# Altium schematic sheet 2.SchDoc
size 386 x 246 mm
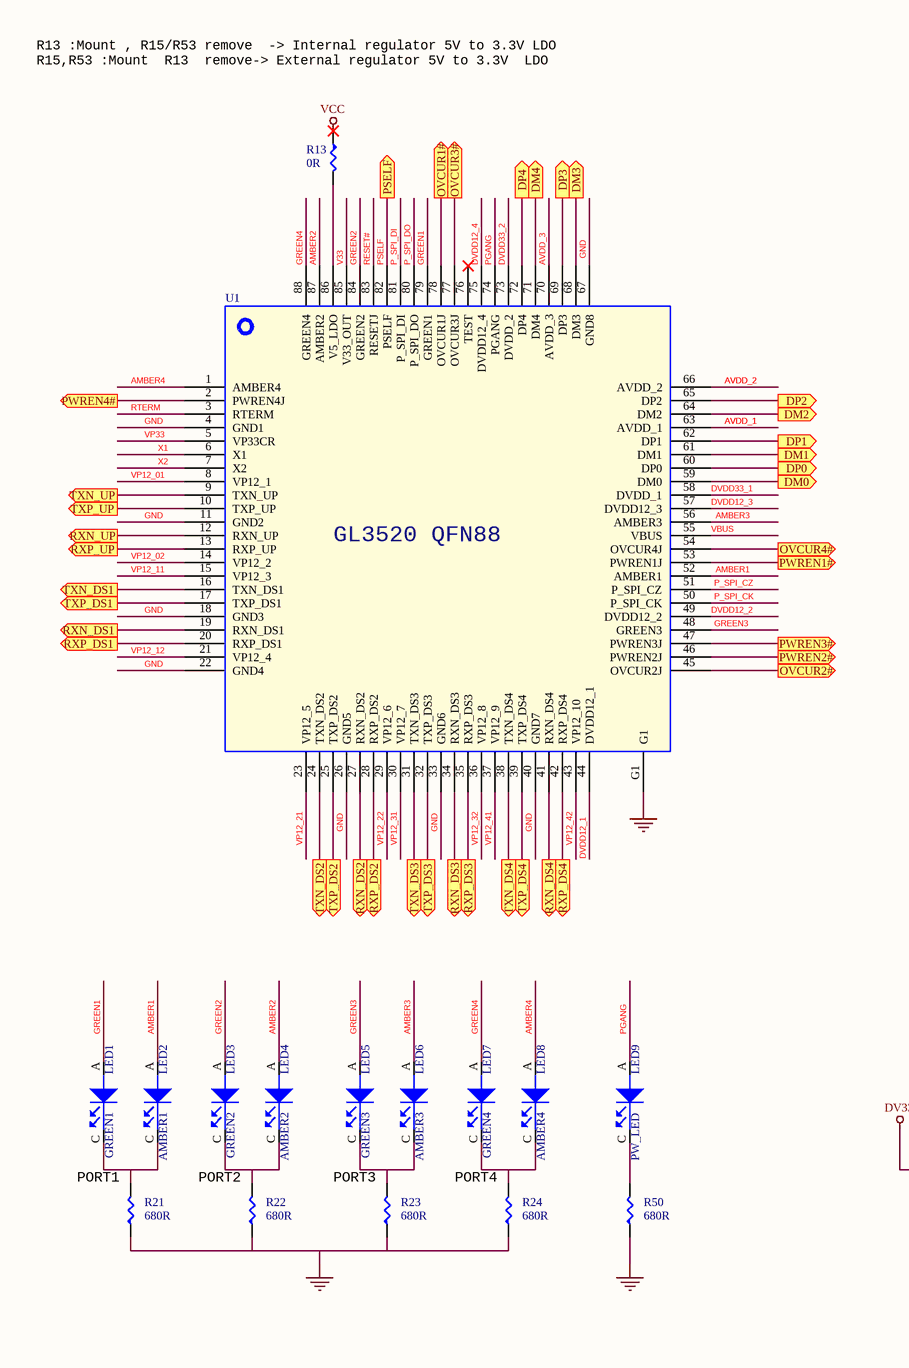
[diagram p0: 2.SchDoc, left]
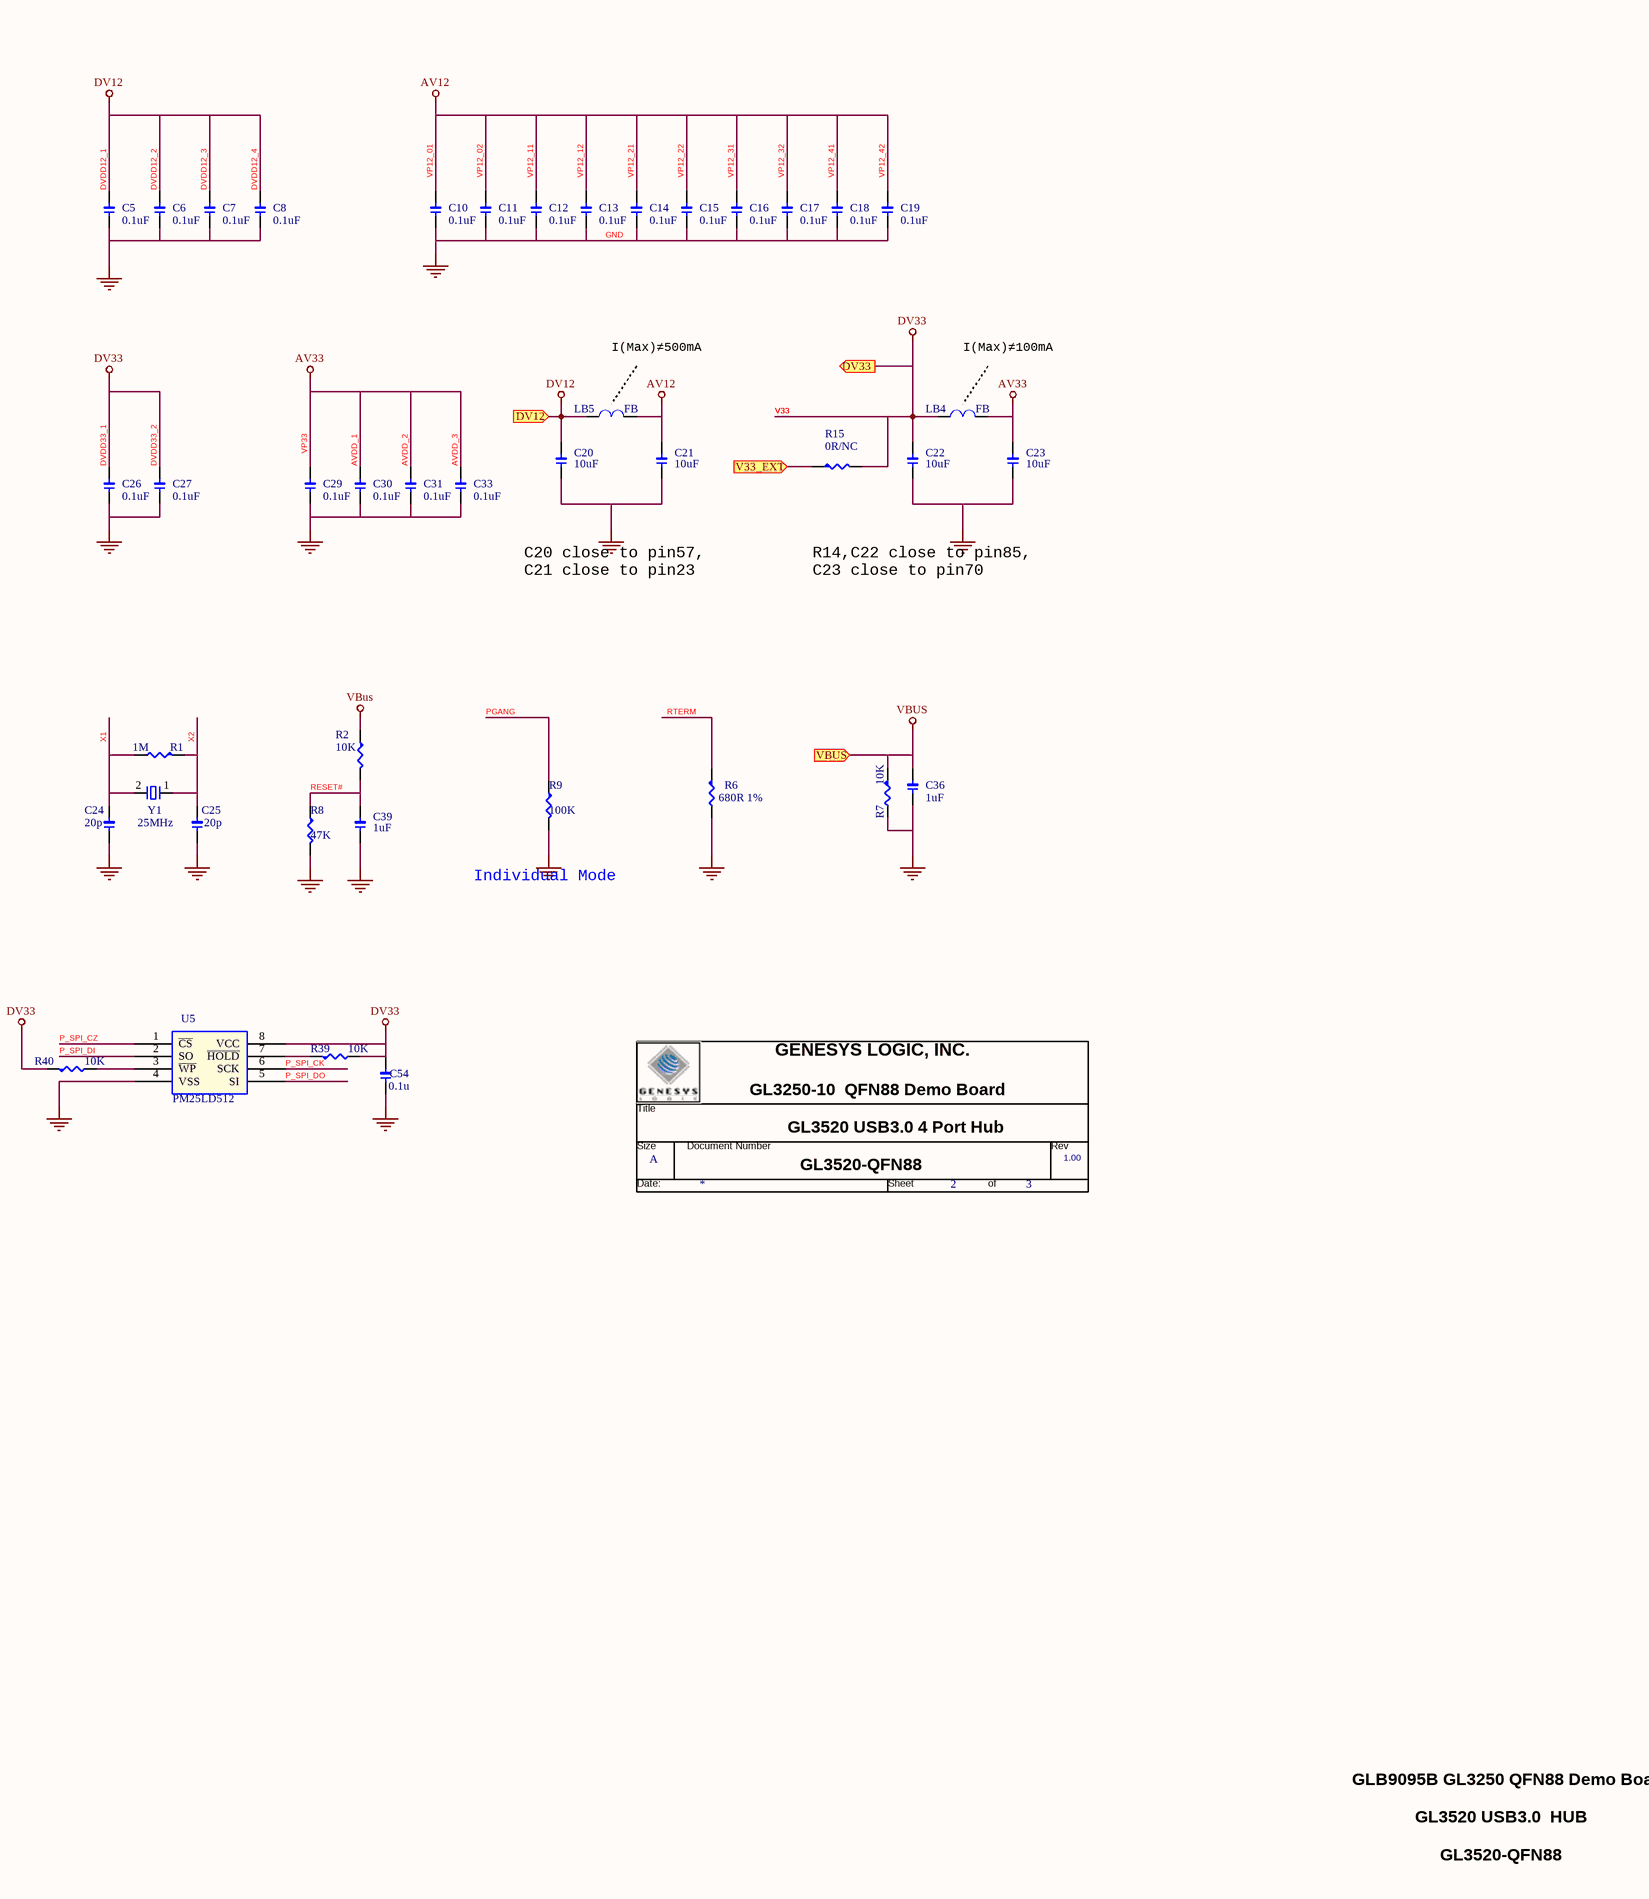
[diagram p1: 2.SchDoc, right]

## Parts
*  Page Count: 3  Page Number: 2  Page Size: A  RevCode: 1.00  (hidden comment: Genesys Logic TitleBlock)  (graphical)
C5  0.1uF  [CCS-0603]
C6  0.1uF  [CCS-0603]
C7  0.1uF  [CCS-0603]
C8  0.1uF  [CCS-0603]
C10  0.1uF  [CCS-0603]
C11  0.1uF  [CCS-0603]
C12  0.1uF  [CCS-0603]
C13  0.1uF  [CCS-0603]
C14  0.1uF  [CCS-0603]
C15  0.1uF  [CCS-0603]
C16  0.1uF  [CCS-0603]
C17  0.1uF  [CCS-0603]
C18  0.1uF  [CCS-0603]
C19  0.1uF  [CCS-0603]
C20  10uF  [CCS-0805]
C21  10uF  [CCS-0805]
C22  10uF  [CCS-0805]
C23  10uF  [CCS-0805]
C24  20p  [CCS-0603]
C25  20p  [CCS-0603]
C26  0.1uF  [CCS-0603]
C27  0.1uF  [CCS-0603]
C29  0.1uF  [CCS-0603]
C30  0.1uF  [CCS-0603]
C31  0.1uF  [CCS-0603]
C33  0.1uF  [CCS-0603]
C36  1uF  [CCS-0603]
C39  1uF  [CCS-0402]
C54  0.1u  [CCS-0603]
LB4  FB  [LBS-0603]
LB5  FB  [LBS-0603]
LED1  GREEN1  [LED-0805]
LED2  AMBER1  [LED-0805]
LED3  GREEN2  [LED-0805]
LED4  AMBER2  [LED-0805]
LED5  GREEN3  [LED-0805]
LED6  AMBER3  [LED-0805]
LED7  GREEN4  [LED-0805]
LED8  AMBER4  [LED-0805]
LED9  PW_LED  [LED-0805]
R1  1M  [R0603]
R2  10K  [RS-0603]
R6  680R 1%  [R0603]
R7  10K  [R0603]
R8  47K  [RS-0603]
R9  100K  [RS-0603]
R13  0R  [RS-0603]
R15  0R/NC  [RS-0603]
R21  680R  [RS-0603]
R22  680R  [RS-0603]
R23  680R  [RS-0603]
R24  680R  [RS-0603]
R39  10K  [R0603]
R40  10K  [R0603]
R50  680R  [RS-0603]
U1  QFN88  [I-LQFP128-0_4A]  (value not drawn)
U5  PM25LD512  [I-SOP8-1_27A]
Y1  25MHz  [XD-49US-A]

## Ports
DM0 (out), DM1 (out), DM2 (out), DM3 (out), DM4 (out), DP0 (out), DP1 (out), DP2 (out), DP3 (out), DP4 (out), DV12 (in), DV33 (out), OVCUR1# (out), OVCUR2# (out), OVCUR3# (out), OVCUR4# (out), PSELF (out), PWREN1# (out), PWREN2# (out), PWREN3# (out), PWREN4# (out), RXN_DS1 (out), RXN_DS2 (out), RXN_DS3 (out), RXN_DS4 (out), RXN_UP (out), RXP_DS1 (out), RXP_DS2 (out), RXP_DS3 (out), RXP_DS4 (out), RXP_UP (out), TXN_DS1 (out), TXN_DS2 (out), TXN_DS3 (out), TXN_DS4 (out), TXN_UP (out), TXP_DS1 (out), TXP_DS2 (out), TXP_DS3 (out), TXP_DS4 (out), TXP_UP (out), V33_EXT (in), VBUS (in)

## Nets
AVDD_1: C23.2 C29.2 C30.2 C31.2 C33.2 LB4.2 U1.5(VP33CR) U1.63(AVDD_1) U1.66(AVDD_2) U1.70(AVDD_3)  [also labelled AV33, AVDD_2, AVDD_3, VP33]
DVDD12_1: C5.2 C6.2 C7.2 C8.2 C20.2 LB5.1 U1.44(DVDD12_1) U1.49(DVDD12_2) U1.57(DVDD12_3) U1.75(DVDD12_4) ; port DV12  [also labelled DV12, DVDD12_2, DVDD12_3, DVDD12_4]
DVDD33_1: C22.2 C26.2 C27.2 C54.2 LB4.1 R15.2 R39.2 R40.1 U1.58(DVDD_1) U1.73(DVDD_2) U1.85(V33_OUT) U5.8(VCC) ; port DV33  [also labelled DV33, DVDD33_2, V33]
GND: C5.1 C6.1 C7.1 C8.1 C10.1 C11.1 C12.1 C13.1 C14.1 C15.1 C16.1 C17.1 C18.1 C19.1 C20.1 C21.1 C22.1 C23.1 C24.1 C25.1 C26.1 C27.1 C29.1 C30.1 C31.1 C33.1 C36.1 C39.1 C54.1 R6.2 R7.2 R8.2 R9.2 R21.1 R22.1 R23.1 R24.1 R50.1 U1.4(GND1) U1.11(GND2) U1.18(GND3) U1.22(GND4) U1.26(GND5) U1.33(GND6) U1.40(GND7) U1.67(GND8) U1.G1 U5.4(VSS)
VBUS: C36.2 R2.1 R7.1 U1.55(VBUS) ; port VBUS
VCC: R13.1
VP12_01: C10.2 C11.2 C12.2 C13.2 C14.2 C15.2 C16.2 C17.2 C18.2 C19.2 C21.2 LB5.2 U1.8(VP12_1) U1.14(VP12_2) U1.15(VP12_3) U1.21(VP12_4) U1.23(VP12_5) U1.29(VP12_6) U1.30(VP12_7) U1.36(VP12_8) U1.37(VP12_9) U1.43(VP12_10)  [also labelled AV12, VP12_02, VP12_11, VP12_12, VP12_21, VP12_22, VP12_31, VP12_32, VP12_41, VP12_42]
AMBER1: LED2.A U1.52(AMBER1)
AMBER2: LED4.A U1.87(AMBER2)
AMBER3: LED6.A U1.56(AMBER3)
AMBER4: LED8.A U1.1(AMBER4)
DM0: U1.59(DM0) ; port DM0
DM1: U1.61(DM1) ; port DM1
DM2: U1.64(DM2) ; port DM2
DM3: U1.68(DM3) ; port DM3
DM4: U1.71(DM4) ; port DM4
DP0: U1.60(DP0) ; port DP0
DP1: U1.62(DP1) ; port DP1
DP2: U1.65(DP2) ; port DP2
DP3: U1.69(DP3) ; port DP3
DP4: U1.72(DP4) ; port DP4
GREEN1: LED1.A U1.79(GREEN1)
GREEN2: LED3.A U1.84(GREEN2)
GREEN3: LED5.A U1.48(GREEN3)
GREEN4: LED7.A U1.88(GREEN4)
OVCUR1#: U1.78(OVCUR1J) ; port OVCUR1#
OVCUR2#: U1.45(OVCUR2J) ; port OVCUR2#
OVCUR3#: U1.77(OVCUR3J) ; port OVCUR3#
OVCUR4#: U1.54(OVCUR4J) ; port OVCUR4#
P_SPI_CK: U1.50(P_SPI_CK) U5.6(SCK)
P_SPI_CZ: U1.51(P_SPI_CZ) U5.1(~{CS})
P_SPI_DI: U1.81(P_SPI_DI) U5.2(SO)
P_SPI_DO: U1.80(P_SPI_DO) U5.5(SI)
PGANG: LED9.A R9.1 U1.74(PGANG)
PSELF: U1.82(PSELF) ; port PSELF
PWREN1#: U1.53(PWREN1J) ; port PWREN1#
PWREN2#: U1.46(PWREN2J) ; port PWREN2#
PWREN3#: U1.47(PWREN3J) ; port PWREN3#
PWREN4#: U1.2(PWREN4J) ; port PWREN4#
RESET#: C39.2 R2.2 R8.1 U1.83(RESETJ)
RTERM: R6.1 U1.3(RTERM)
RXN_DS1: U1.19(RXN_DS1) ; port RXN_DS1
RXN_DS2: U1.27(RXN_DS2) ; port RXN_DS2
RXN_DS3: U1.34(RXN_DS3) ; port RXN_DS3
RXN_DS4: U1.41(RXN_DS4) ; port RXN_DS4
RXN_UP: U1.12(RXN_UP) ; port RXN_UP
RXP_DS1: U1.20(RXP_DS1) ; port RXP_DS1
RXP_DS2: U1.28(RXP_DS2) ; port RXP_DS2
RXP_DS3: U1.35(RXP_DS3) ; port RXP_DS3
RXP_DS4: U1.42(RXP_DS4) ; port RXP_DS4
RXP_UP: U1.13(RXP_UP) ; port RXP_UP
TXN_DS1: U1.16(TXN_DS1) ; port TXN_DS1
TXN_DS2: U1.24(TXN_DS2) ; port TXN_DS2
TXN_DS3: U1.31(TXN_DS3) ; port TXN_DS3
TXN_DS4: U1.38(TXN_DS4) ; port TXN_DS4
TXN_UP: U1.9(TXN_UP) ; port TXN_UP
TXP_DS1: U1.17(TXP_DS1) ; port TXP_DS1
TXP_DS2: U1.25(TXP_DS2) ; port TXP_DS2
TXP_DS3: U1.32(TXP_DS3) ; port TXP_DS3
TXP_DS4: U1.39(TXP_DS4) ; port TXP_DS4
TXP_UP: U1.10(TXP_UP) ; port TXP_UP
V33_EXT: R15.1 ; port V33_EXT
X1: C24.2 R1.2 U1.6(X1) Y1.2
X2: C25.2 R1.1 U1.7(X2) Y1.1
NetLED1_C: LED1.C LED2.C R21.2
NetLED3_C: LED3.C LED4.C R22.2
NetLED5_C: LED5.C LED6.C R23.2
NetLED7_C: LED7.C LED8.C R24.2
NetLED9_C: LED9.C R50.2
NetR13_2: R13.2 U1.86(V5_LDO)
NetR39_1: R39.1 U5.7(~{HOLD})
NetR40_2: R40.2 U5.3(~{WP})

Not connected (* = marked no-connect by the designer): U1 76(TEST)*

## Notes on the sheet
- R13 :Mount , R15/R53 remove  -> Internal regulator 5V to 3.3V LDO
  R15,R53 :Mount  R13  remove-> External regulator 5V to 3.3V  LDO
- I(Max)≠500mA
- I(Max)≠100mA
- C20 close to pin57,
  C21 close to pin23
- R14,C22 close to pin85,
  C23 close to pin70
- Individual Mode
- (near R21) PORT1
- (near R22) PORT2
- (near R23) PORT3
- (near R24) PORT4
- GL3250-10  QFN88 Demo Board
- GL3520 USB3.0 4 Port Hub
- GL3520-QFN88
- GLB9095B GL3250 QFN88 Demo Board
- GL3520 USB3.0  HUB
- (in symbol Genesys Logic TitleBlock) GENESYS LOGIC, INC.; Title; Size; Document Number; Rev; Date:; Sheet; of
- (in symbol GL3520_QFN88_V094-1_18) GL3520 QFN88

## Library data of the parts
C5-C8 C10-C19 C24-C27 C29-C31 C33 C36 = C-0603 5%: xGLA pn: 10-00005-01; PCB Footprint: CCS-0603
C20-C23 = C-0805: PCB Footprint: CCS-0805
C39 = C-0402: PCB Footprint: CCS-0603
C54 = C-0603 5%: BOM: SMD-CAP 10pF (0603) 5%; PCB Footprint: CCS-0603
LB4 LB5 = L-0603: PCB Footprint: LBS-0603
LED1-LED9 = LED-0805: PCB Footprint: LED-0805
R1 = R330-0603 5%: CLASS: DISCRETE; BOM: SMD-R 330 (0603) 5%; xGLA pn: 13-00009-01; PCB Footprint: RS-0603
R2 R8 R9 R13 R15 R21-R24 R50 = R-0603: PCB Footprint: RS-0603
R6 R39 R40 = R-0603 5%: CLASS: DISCRETE; BOM: SMD-R ?K (0603) 5%; PCB Footprint: RS-0603
R7 = R-0603 5%: CLASS: DISCRETE; BOM: SMD-R ?K (0603) 5%; PCB Footprint: RS-0805
U1 = GL3520_QFN88_V094-1_18: PCB Footprint: I-QFN88-10X10X0_4A
U5 = CAT25C128/256: PCB Footprint: I-SOP8-1_27A
Y1 = XTAL-HALF: BOM: DIP-XTAL ?MHz HALF <TXC>; PCB Footprint: XS-49US-A; xGLA pn: 24-00002-01
* = Genesys Logic TitleBlock: Page Create Date: March  8, 1995; Page Modify Date: *